# Altium schematic sheet RK3576-SMC.PMIC_BUCK (0021.0 A0).SchDoc
size 420 x 297 mm; Scale: -; DocumentType: Схема электрическая принципиальная; DocumentGOSTLIt1: ㅤ; DocumentGOSTLIt2: ㅤ; DocumentGOSTLIt3: ㅤ; DocumentGOSTNote: Элементы, отмеченные *, используются при трассировке печатной платы, в состав модуля не включаются; SheetNumber: 4; SheetTotal: 7; DocumentTypeShort: Э3; DocumentInvertoryNumber: ㅤ
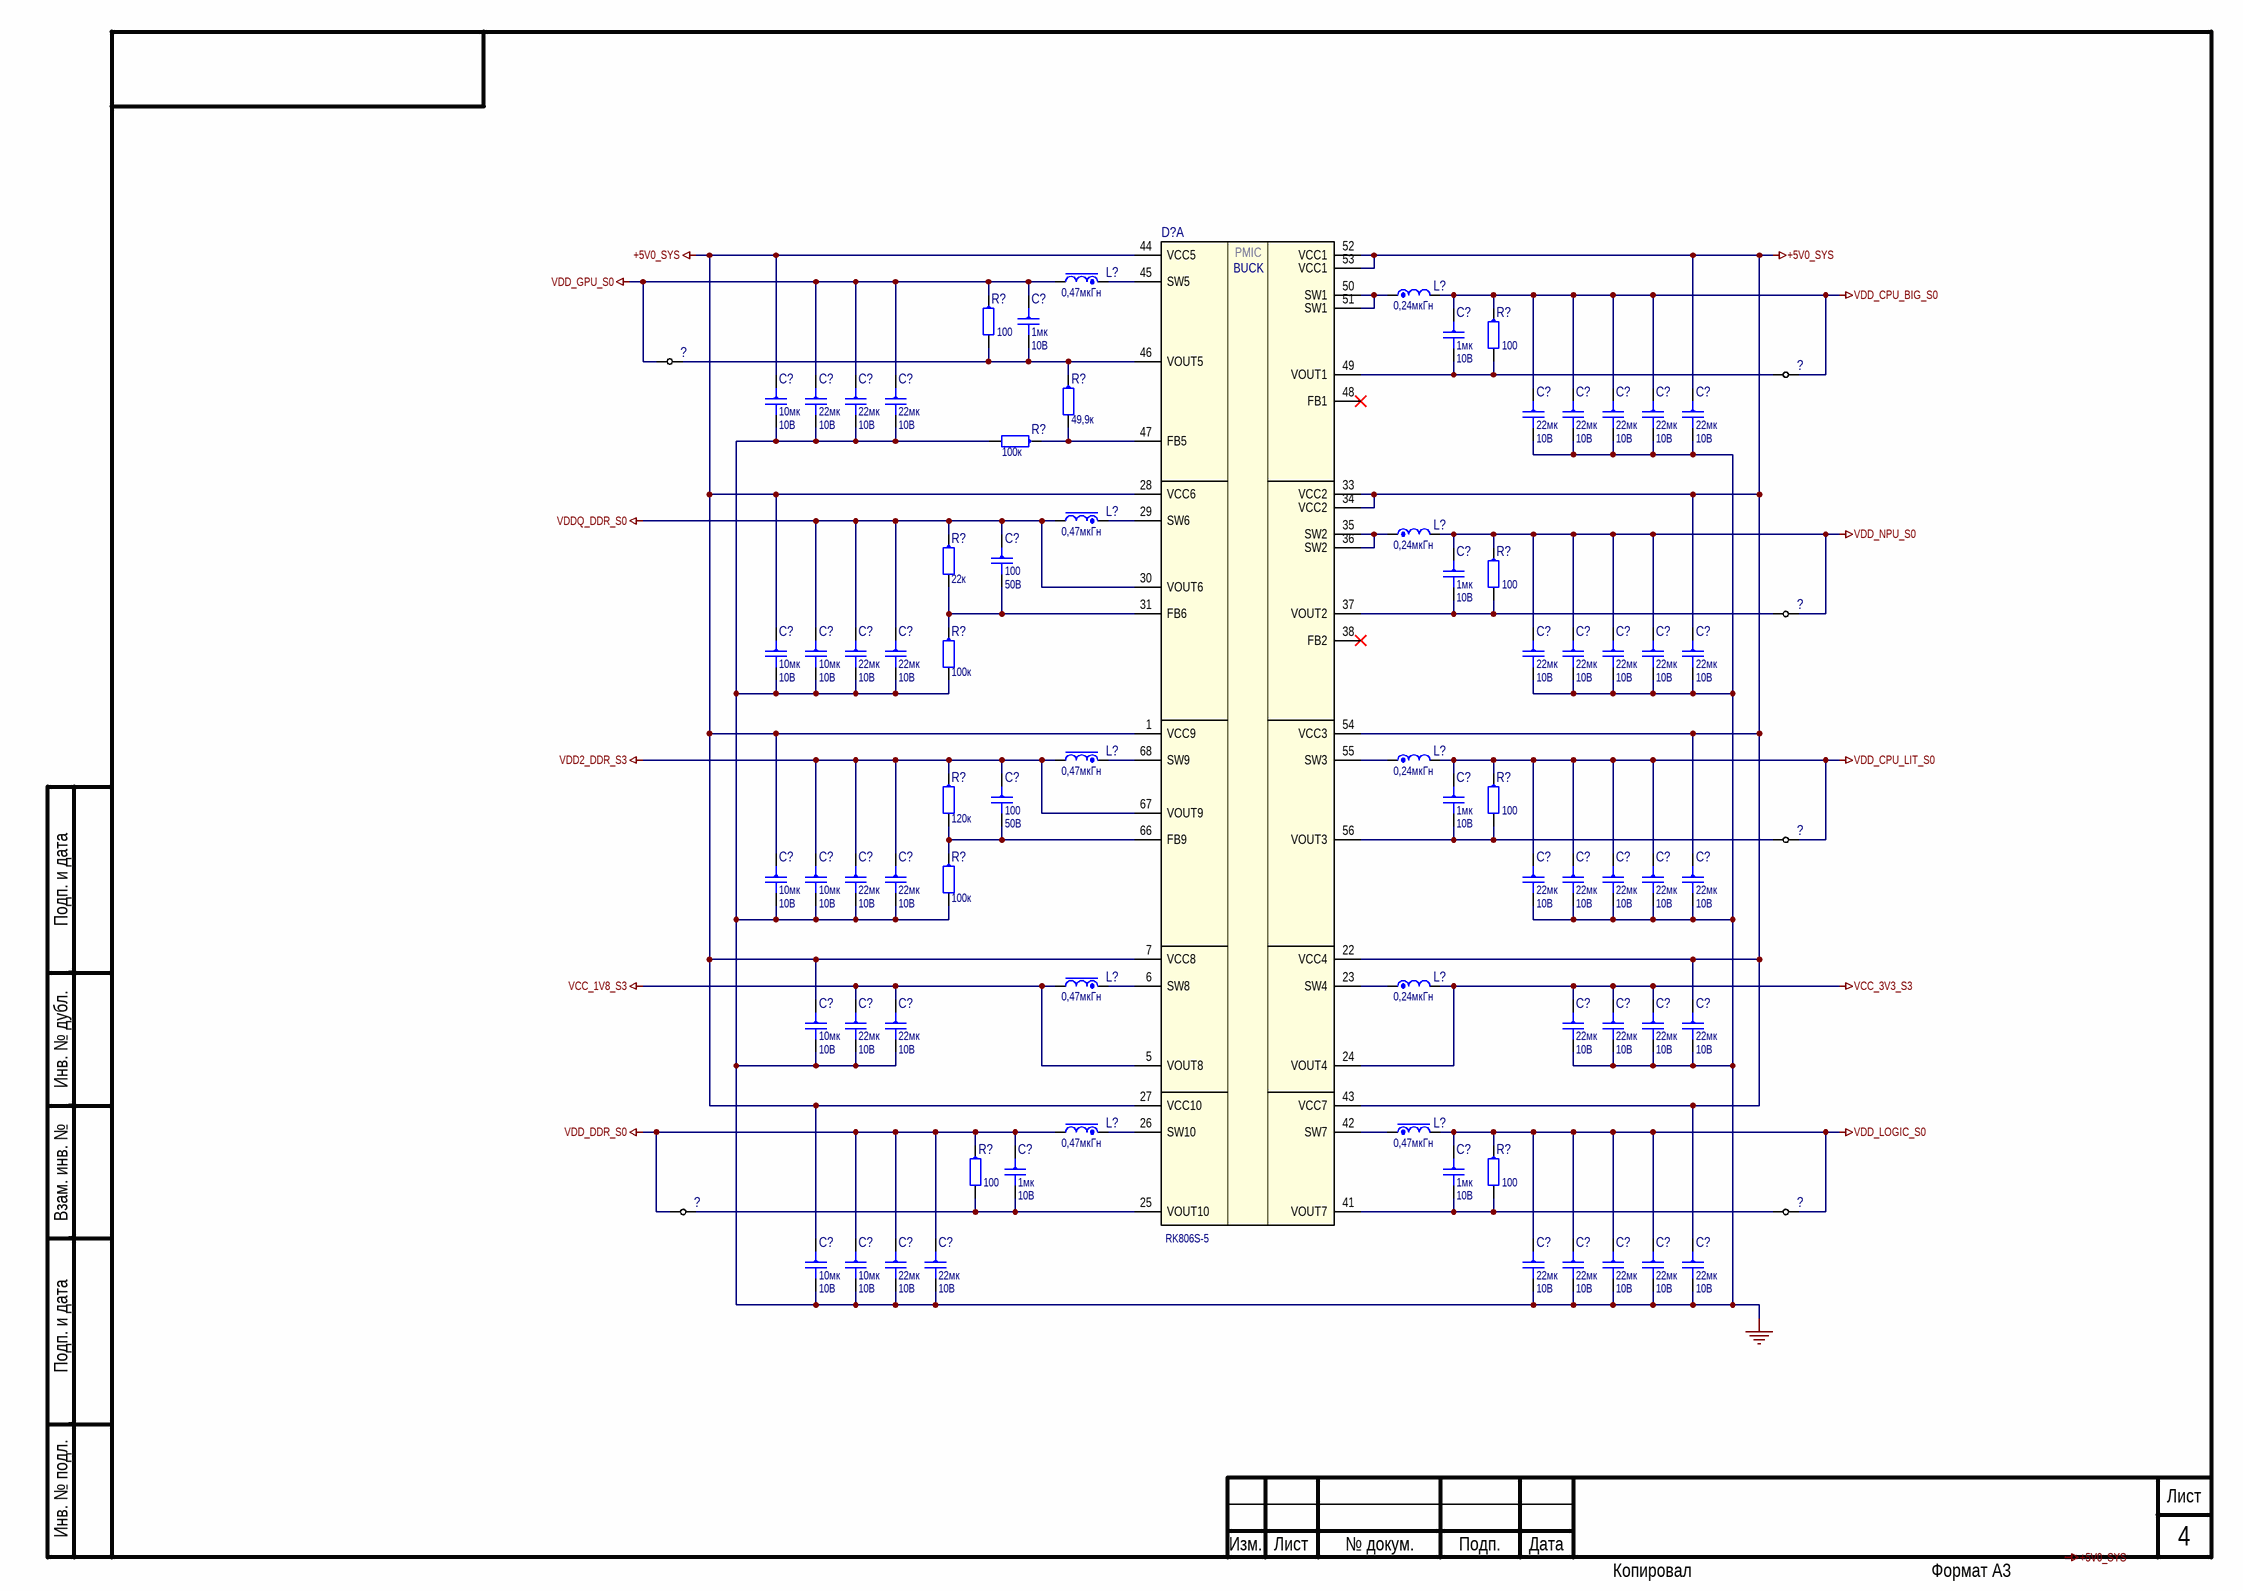
[diagram p0: RK3576-SMC.PMIC_BUCK (0021.0 A0).SchDoc]

## Parts
(Parts that share a designator on the sheet are numbered #1, #2 ... from top to bottom, then left to right.)
?#1  NetTie  [NetTie_0_6-1_25mm_close]  (value not drawn)  (net tie, no BOM)
?#2  NetTie  [NetTie_0_6-1_25mm_close]  (value not drawn)  (net tie, no BOM)
?#3  NetTie  [NetTie_0_6-1_25mm_close]  (value not drawn)  (net tie, no BOM)
?#4  NetTie  [NetTie_0_6-1_25mm_close]  (value not drawn)  (net tie, no BOM)
?#5  NetTie  [NetTie_0_6-1_25mm_close]  (value not drawn)  (net tie, no BOM)
?#6  NetTie  [NetTie_0_6-1_25mm_close]  (value not drawn)  (net tie, no BOM)
C?#1  1мк  Напряжение: 10В  [capc1005x55n]
C?#2  1мк  Напряжение: 10В  [capc1005x55n]
C?#3  10мк  Напряжение: 10В  [capc1608x100n]
C?#4  22мк  Напряжение: 10В  [capc1608x100n]
C?#5  22мк  Напряжение: 10В  [capc1608x100n]
C?#6  22мк  Напряжение: 10В  [capc1608x100n]
C?#7  22мк  Напряжение: 10В  [capc1608x100n]
C?#8  22мк  Напряжение: 10В  [capc1608x100n]
C?#9  22мк  Напряжение: 10В  [capc1608x100n]
C?#10  22мк  Напряжение: 10В  [capc1608x100n]
C?#11  22мк  Напряжение: 10В  [capc1608x100n]
C?#12  100  Напряжение: 50В  [capc1005x55n]
C?#13  1мк  Напряжение: 10В  [capc1005x55n]
C?#14  10мк  Напряжение: 10В  [capc1608x100n]
C?#15  10мк  Напряжение: 10В  [capc1608x100n]
C?#16  22мк  Напряжение: 10В  [capc1608x100n]
C?#17  22мк  Напряжение: 10В  [capc1608x100n]
C?#18  22мк  Напряжение: 10В  [capc1608x100n]
C?#19  22мк  Напряжение: 10В  [capc1608x100n]
C?#20  22мк  Напряжение: 10В  [capc1608x100n]
C?#21  22мк  Напряжение: 10В  [capc1608x100n]
C?#22  22мк  Напряжение: 10В  [capc1608x100n]
C?#23  100  Напряжение: 50В  [capc1005x55n]
C?#24  1мк  Напряжение: 10В  [capc1005x55n]
C?#25  10мк  Напряжение: 10В  [capc1608x100n]
C?#26  10мк  Напряжение: 10В  [capc1608x100n]
C?#27  22мк  Напряжение: 10В  [capc1608x100n]
C?#28  22мк  Напряжение: 10В  [capc1608x100n]
C?#29  22мк  Напряжение: 10В  [capc1608x100n]
C?#30  22мк  Напряжение: 10В  [capc1608x100n]
C?#31  22мк  Напряжение: 10В  [capc1608x100n]
C?#32  22мк  Напряжение: 10В  [capc1608x100n]
C?#33  22мк  Напряжение: 10В  [capc1608x100n]
C?#34  10мк  Напряжение: 10В  [capc1608x100n]
C?#35  22мк  Напряжение: 10В  [capc1608x100n]
C?#36  22мк  Напряжение: 10В  [capc1608x100n]
C?#37  22мк  Напряжение: 10В  [capc1608x100n]
C?#38  22мк  Напряжение: 10В  [capc1608x100n]
C?#39  22мк  Напряжение: 10В  [capc1608x100n]
C?#40  22мк  Напряжение: 10В  [capc1608x100n]
C?#41  1мк  Напряжение: 10В  [capc1005x55n]
C?#42  1мк  Напряжение: 10В  [capc1005x55n]
C?#43  10мк  Напряжение: 10В  [capc1608x100n]
C?#44  10мк  Напряжение: 10В  [capc1608x100n]
C?#45  22мк  Напряжение: 10В  [capc1608x100n]
C?#46  22мк  Напряжение: 10В  [capc1608x100n]
C?#47  22мк  Напряжение: 10В  [capc1608x100n]
C?#48  22мк  Напряжение: 10В  [capc1608x100n]
C?#49  22мк  Напряжение: 10В  [capc1608x100n]
C?#50  22мк  Напряжение: 10В  [capc1608x100n]
C?#51  22мк  Напряжение: 10В  [capc1608x100n]
D?  RK806S-5  [qfn35p700x700x90-69_hsn]  (part A of 3)
L?#1  0,47мкГн  [indm2016x100n]
L?#2  0,24мкГн  [inddfn250x200x120-2n_v1]
L?#3  0,47мкГн  [indm2016x100n]
L?#4  0,24мкГн  [inddfn250x200x120-2n_v1]
L?#5  0,47мкГн  [indm2016x100n]
L?#6  0,24мкГн  [inddfn250x200x120-2n_v1]
L?#7  0,47мкГн  [indm2016x100n]
L?#8  0,24мкГн  [inddfn250x200x120-2n_v1]
L?#9  0,47мкГн  [indm2016x100n]
L?#10  0,47мкГн  [indm2016x100n]
R?#1  100  [resc1005x40n]
R?#2  100  [resc1005x40n]
R?#3  49,9к  [resc1005x40n]
R?#4  100к  [resc1005x40n]
R?#5  22к  [resc1005x40n]
R?#6  100  [resc1005x40n]
R?#7  100к  [resc1005x40n]
R?#8  120к  [resc1005x40n]
R?#9  100  [resc1005x40n]
R?#10  100к  [resc1005x40n]
R?#11  100  [resc1005x40n]
R?#12  100  [resc1005x40n]

## Nets
+5V0_SYS: C?#3.1 C?#11.1 C?#14.1 C?#22.1 C?#25.1 C?#33.1 C?#34.1 C?#40.1 C?#43.1 C?#51.1 D?.1(VCC9) D?.7(VCC8) D?.22(VCC4) D?.27(VCC10) D?.28(VCC6) D?.33(VCC2) D?.34(VCC2) D?.43(VCC7) D?.44(VCC5) D?.52(VCC1) D?.53(VCC1) D?.54(VCC3)
SOM.GND: C?#3.2 C?#4.2 C?#5.2 C?#6.2 C?#7.2 C?#8.2 C?#9.2 C?#10.2 C?#11.2 C?#14.2 C?#15.2 C?#16.2 C?#17.2 C?#18.2 C?#19.2 C?#20.2 C?#21.2 C?#22.2 C?#25.2 C?#26.2 C?#27.2 C?#28.2 C?#29.2 C?#30.2 C?#31.2 C?#32.2 C?#33.2 C?#34.2 C?#35.2 C?#36.2 C?#37.2 C?#38.2 C?#39.2 C?#40.2 C?#43.2 C?#44.2 C?#45.2 C?#46.2 C?#47.2 C?#48.2 C?#49.2 C?#50.2 C?#51.2 R?#4.2 R?#7.2 R?#10.2
VCC_1V8_S3: C?#35.1 C?#36.1 D?.5(VOUT8) L?#7.2
VCC_3V3_S3: C?#37.1 C?#38.1 C?#39.1 D?.24(VOUT4) L?#8.2
VDD2_DDR_S3: C?#23.1 C?#26.1 C?#27.1 C?#28.1 D?.67(VOUT9) L?#5.2 R?#8.1
VDD_CPU_BIG_S0: ?#2.2 C?#2.1 C?#7.1 C?#8.1 C?#9.1 C?#10.1 L?#2.2 R?#2.1
VDD_CPU_LIT_S0: ?#4.2 C?#24.1 C?#29.1 C?#30.1 C?#31.1 C?#32.1 L?#6.2 R?#9.1
VDD_DDR_S0: ?#5.1 C?#41.1 C?#44.1 C?#45.1 C?#46.1 L?#9.2 R?#11.1
VDD_GPU_S0: ?#1.1 C?#1.1 C?#4.1 C?#5.1 C?#6.1 L?#1.2 R?#1.1
VDD_LOGIC_S0: ?#6.2 C?#42.1 C?#47.1 C?#48.1 C?#49.1 C?#50.1 L?#10.2 R?#12.1
VDD_NPU_S0: ?#3.2 C?#13.1 C?#18.1 C?#19.1 C?#20.1 C?#21.1 L?#4.2 R?#6.1
VDDQ_DDR_S0: C?#12.1 C?#15.1 C?#16.1 C?#17.1 D?.30(VOUT6) L?#3.2 R?#5.1
Net?#1_2: ?#1.2 C?#1.2 D?.46(VOUT5) R?#1.2 R?#3.1
Net?#2_1: ?#2.1 C?#2.2 D?.49(VOUT1) R?#2.2
Net?#3_1: ?#3.1 C?#13.2 D?.37(VOUT2) R?#6.2
Net?#4_1: ?#4.1 C?#24.2 D?.56(VOUT3) R?#9.2
Net?#5_2: ?#5.2 C?#41.2 D?.25(VOUT10) R?#11.2
Net?#6_1: ?#6.1 C?#42.2 D?.41(VOUT7) R?#12.2
NetC?#12_2: C?#12.2 D?.31(FB6) R?#5.2 R?#7.1
NetC?#23_2: C?#23.2 D?.66(FB9) R?#8.2 R?#10.1
NetD?_6: D?.6(SW8) L?#7.1
NetD?_23: D?.23(SW4) L?#8.1
NetD?_26: D?.26(SW10) L?#9.1
NetD?_29: D?.29(SW6) L?#3.1
NetD?_35: D?.35(SW2) D?.36(SW2) L?#4.1
NetD?_42: D?.42(SW7) L?#10.1
NetD?_45: D?.45(SW5) L?#1.1
NetD?_47: D?.47(FB5) R?#3.2 R?#4.1
NetD?_50: D?.50(SW1) D?.51(SW1) L?#2.1
NetD?_55: D?.55(SW3) L?#6.1
NetD?_68: D?.68(SW9) L?#5.1

Not connected (* = marked no-connect by the designer): D? 38(FB2)* 48(FB1)*

## Notes on the sheet
- Labels drawn without touching a wire or pin: +5V0_SYS
- Подп. и дата
- Инв. № дубл.
- Взам. инв. №
- Инв. № подл.
- Изм.
- Лист
- № докум.
- Подп.
- Дата
- Копировал
- Формат А3
- (in symbol RK806S-5, part A) PMIC; BUCK

## Library data of the parts
?#1-?#6 = NetTie_0.6-1.25_Close: Part_ID: ATB-00257; Rule: UNIONINDEX=0|RULEKIND=Clearance|NETSCOPE=DifferentNets|LAYERKIND=SameLayer|NAME=Schematic Clearance Constraint|GAP=0mil|GENERICCLEARANCE=0mil|IGNOREPADTOPADCLEARANCEINFOOTPRINT=TRUE|OBJECTCLEARANCES= |UNIT=Metric; Rule: UNIONINDEX=0|RULEKIND=PolygonConnect|NETSCOPE=AnyNet|LAYERKIND=SameLayer|NAME=Schematic Polygon Connect Style|CONNECTSTYLE=Direct|RELIEFCONDUCTORWIDTH=10mil|RELIEFENTRIES=4|POLYGONRELIEFANGLE=45 Angle|AIRGAPWIDTH=10mil|UNIT=Metric; Rule: UNIONINDEX=0|RULEKIND=ShortCircuit|NETSCOPE=AnyNet|LAYERKIND=SameLayer|NAME=Schematic Short-Circuit Constraint|ALLOWED=TRUE|UNIT=Metric; Тип ЭКБ: Элементы; Тип компонента: Перемычка; Автор: Чепиков И.В.; Part Number: NetTie_0.6-1.25_Close; Наименование: NetTie_0.6-1.25_Close; Value: -; Part_Number: NetTie_0.6-1.25_Close; Дата: 11.11.2024; Device: NetTie_0.6-1.25_Close; NameFromManufacturer: NetTie_0.6-1.25_Close
C?#1 C?#2 C?#13 C?#24 C?#41 C?#42 = CC0402KRX5R6BB105: Part_ID: ATB-00690; Manufacturer: Yageo; Schematic_Part: C_min_val,C_min,C_val,C; Тип ЭКБ: Конденсаторы; Наименование: 0402-X5R-10V-1uF±10%; Тип компонента: Конденсатор керамический; Value: 1uF; Voltage: 10V; Температура: -55 +85; PCB_Footprint: capc1005x55,capc1005x55n; Тип корпуса: Chip; Видоразмер: 1005; Вариант установки: Поверхностный; Код ERP: E2-00028722; Photo: Photos\Photos\Yageo_Capacitors.jpg; Автор: Чепиков И.В.; Точность: 10%; Device: 0402-X5R-10V-1uF±10%_Yageo; Library Ref 2: C; Library Ref 3: Cshort; Part Number: CC0402KRX5R6BB105; Datasheet: Datasheets\Capacitors\UPY-GPHC_X5R_4V-to-50V_30.pdf; Номинал: 1мк; Part_Number: CC0402KRX5R6BB105; Height: 0.55; Производитель: Yageo; Website: https://www.yageo.com/upload/media/product/productsearch/datasheet/mlcc/UPY-GPHC_X5R_4V-to-50V_30.pdf; Дата: 23.09.2024; ComponentLink1Description: UPY-GPHC_X5R_4V-to-50V_30.pdf; ComponentLink1URL: https://www.yageo.com/upload/media/product/productsearch/datasheet/mlcc/UPY-GPHC_X5R_4V-to-50V_30.pdf; NameFromManufacturer: CC0402KRX5R6BB105; Original PN: CC0402KRX5R6BB105
C?#3 C?#14 C?#15 C?#25 C?#26 C?#34 C?#43 C?#44 = CC0603KRX5R6BB106: Part_ID: ATB-01068; Manufacturer: Yageo; Schematic_Part: C_min_val,C_min,C_val,C; Тип ЭКБ: Конденсаторы; Наименование: 0603-X5R-10V-10uF±10%; Тип компонента: Конденсатор керамический; Value: 10uF; Voltage: 10V; Температура: -55 +85; Тип корпуса: Chip; Видоразмер: 1608; Вариант установки: Поверхностный; Код ERP: E2-00029011; Photo: Photos\Photos\Yageo_Capacitors.jpg; Автор: Чепиков И.В.; Точность: 10%; Device: 0603-X5R-10V-10uF±10%_Yageo; Library Ref 2: C; Library Ref 3: Cshort; Part Number: CC0603KRX5R6BB106; Datasheet: Datasheets\Capacitors\UPY-GPHC_X5R_4V-to-50V_30.pdf; Номинал: 10мк; Part_Number: CC0603KRX5R6BB106; PCB_Footprint: capc1608x100n; Height: 1; Производитель: Yageo; Website: https://www.yageo.com/upload/media/product/productsearch/datasheet/mlcc/UPY-GPHC_X5R_4V-to-50V_30.pdf; Дата: 25.09.2024; ComponentLink1Description: UPY-GPHC_X5R_4V-to-50V_30.pdf; ComponentLink1URL: https://www.yageo.com/upload/media/product/productsearch/datasheet/mlcc/UPY-GPHC_X5R_4V-to-50V_30.pdf; NameFromManufacturer: CC0603KRX5R6BB106; Original PN: CC0603KRX5R6BB106
C?#4-C?#11 C?#16-C?#22 C?#27-C?#33 C?#35-C?#40 C?#45-C?#51 = CC0603MRX5R6BB226: Part_ID: ATB-01072; Manufacturer: Yageo; Schematic_Part: C_min_val,C_min,C_val,C; Тип ЭКБ: Конденсаторы; Наименование: 0603-X5R-10V-22uF±20%; Тип компонента: Конденсатор керамический; Value: 22uF; Voltage: 10V; Температура: -55 +85; Тип корпуса: Chip; Видоразмер: 1608; Вариант установки: Поверхностный; Код ERP: E2-00006861; Photo: Photos\Photos\Yageo_Capacitors.jpg; Автор: Чепиков И.В.; Точность: 20%; Device: 0603-X5R-10V-22uF±20%_Yageo; Library Ref 2: C; Library Ref 3: Cshort; Part Number: CC0603MRX5R6BB226; Datasheet: Datasheets\Capacitors\UPY-GPHC_X5R_4V-to-50V_30.pdf; Номинал: 22мк; Part_Number: CC0603MRX5R6BB226; PCB_Footprint: capc1608x100n; Height: 1; Производитель: Yageo; Website: https://www.yageo.com/upload/media/product/productsearch/datasheet/mlcc/UPY-GPHC_X5R_4V-to-50V_30.pdf; Дата: 25.09.2024; ComponentLink1Description: UPY-GPHC_X5R_4V-to-50V_30.pdf; ComponentLink1URL: https://www.yageo.com/upload/media/product/productsearch/datasheet/mlcc/UPY-GPHC_X5R_4V-to-50V_30.pdf; NameFromManufacturer: CC0603MRX5R6BB226; Original PN: CC0603MRX5R6BB226
C?#12 C?#23 = CC0402JRNPO9BN101: Part_ID: ATB-03397; Manufacturer: Yageo; Schematic_Part: C_min_val,C_min,C_val,C; Тип ЭКБ: Конденсаторы; Наименование: 0402-NP0-50V-100pF±5%; Тип компонента: Конденсатор керамический; Value: 100pF; Voltage: 50V; Температура: -55 +125; PCB_Footprint: capc1005x55,capc1005x55n; Тип корпуса: Chip; Видоразмер: 1005; Вариант установки: Поверхностный; Photo: Photos\Photos\Yageo_Capacitors.jpg; Автор: Чепиков И.В.; Точность: 5%; Device: 0402-NP0-50V-100pF±5%_Yageo; Library Ref 2: C; Library Ref 3: Cshort; Part Number: CC0402JRNPO9BN101; Datasheet: Datasheets\Capacitors\UPY-GP_NP0_16V-to-250V_19.pdf; Номинал: 100; Part_Number: CC0402JRNPO9BN101; Height: 0.55; Производитель: Yageo; Website: https://www.yageo.com/upload/media/product/productsearch/datasheet/mlcc/UPY-GP_NP0_16V-to-250V_19.pdf; Дата: 15.10.2024; ComponentLink1Description: UPY-GP_NP0_16V-to-250V_19.pdf; ComponentLink1URL: https://www.yageo.com/upload/media/product/productsearch/datasheet/mlcc/UPY-GP_NP0_16V-to-250V_19.pdf; NameFromManufacturer: CC0402JRNPO9BN101; Original PN: CC0402JRNPO9BN101
D? = RK806S-5: Power-management integrated circuit; Part_ID: ATB-08063; Manufacturer: Rockchip; Тип ЭКБ: Микросхемы; Тип компонента: Контроллеры; Voltage: 2.7 - 5.5; Температура: -40 +125; Тип корпуса: QFN7x7-68; Вариант установки: Поверхностный; Photo: Photos\Photos\Rockchip_RK806-1.jpg; Автор: Чепиков И.В.; Part Number: RK806S-5; Наименование: RK806S-5; Datasheet: Datasheets\Microcircuits\Rockchip_RK806S_Datasheet_V1.5.pdf; Schematic_Part: RK806-1; Value: RK806S-5; Part_Number: RK806S-5; PCB_Footprint: qfn35p700x700x90-69_hsn; Height: 0.9; Производитель: Rockchip; Дата: 16.09.2025; Device: RK806S-5; ComponentLink1Description: Rockchip_RK806S_Datasheet_V1.5.pdf; NameFromManufacturer: RK806S-5; Original PN: RK806S-5
L?#1 L?#3 L?#5 L?#7 L?#9 L?#10 = WIP201610P-R47ML: SMT 2016, 0,47 мкГн, 20%, 3,5 А; Part_ID: ATB-08092; Manufacturer: Inpaq; Schematic_Part: L,L_Core; Тип ЭКБ: Дроссели; Тип компонента: Дроссель; Value: 470nH; Температура: -40 +125; Тип корпуса: Molded; Вариант установки: Поверхностный; Photo: Photos\Photos\Inpaq_WIP201610P-R47ML.jpg; Автор: Чепиков И.В.; Library Ref 2: Lcore; ComponentLink1Description: WIP201610P_L_Series.pdf; ComponentLink1URL: https://www.lcsc.com/product-detail/C964105.html?s_z=n_WIP201610P-R47ML; Part Number: WIP201610P-R47ML; Наименование: WIP201610P-R47ML; Datasheet: Datasheets\Chokes\WIP201610P_L_Series.pdf; Номинал: 0,47мкГн; Part_Number: WIP201610P-R47ML; PCB_Footprint: indm2016x100n; Height: 1; Производитель: Inpaq; Website: https://www.lcsc.com/product-detail/C964105.html?s_z=n_WIP201610P-R47ML; Точность: 20%; Дата: 17.09.2025; Device: WIP201610P-R47ML; NameFromManufacturer: WIP201610P-R47ML; Original PN: WIP201610P-R47ML
L?#2 L?#4 L?#6 L?#8 = WPN252012HR24MT: SMT 2520, 0,24 мкГн, 20%, 4,05 А; Part_ID: ATB-10004; Manufacturer: Sunlord; Schematic_Part: L; Тип ЭКБ: Дроссели; Тип компонента: Катушка индуктивности; Value: 240nH; Температура: -40 +125; Тип корпуса: DFN; Вариант установки: Поверхностный; Код ERP: E2-00040440; Photo: Photos\Photos\Sunlord_WPN252012H1R0MT.jpg; Автор: Чепиков И.В.; ComponentLink1Description: WPN Series Sunlord.pdf; ComponentLink1URL: https://www.sunlordinc.com/uploads/files/20240807/cn/WPN%C2%A0Series%C2%A0of%C2%A0SMD%C2%A0Power%C2%A0Inductor.pdf; Part Number: WPN252012HR24MT; Наименование: WPN252012HR24MT; Datasheet: Datasheets\Chokes\WPN Series Sunlord.pdf; Номинал: 0,24мкГн; Part_Number: WPN252012HR24MT; PCB_Footprint: inddfn250x200x120-2n_v1; Height: 1.2; Производитель: Sunlord; Website: https://www.sunlordinc.com/uploads/files/20240807/cn/WPN%C2%A0Series%C2%A0of%C2%A0SMD%C2%A0Power%C2%A0Inductor.pdf; Точность: 20%; Дата: 27.05.2025; Device: WPN252012HR24MT; Library Ref 2: L; NameFromManufacturer: WPN252012HR24MT; Original PN: WPN252012HR24MT
R?#1 R?#2 R?#6 R?#9 R?#11 R?#12 = RC0402FR-07100RL: Резисторы (chip) общего назначения; Part_ID: ATB-00718; Manufacturer: Yageo; Schematic_Part: R_min_val,R_min,R_val,R; Наименование: 0402-0.063W-100-100ppm±1%; Voltage: 50V; Power: 0.063; Точность: ±1%; ТКС (от  -60 до +20 град): ± 100; Ряд: E24; Температура: -55 +155; Вариант установки: Поверхностный; Код ERP: E2-00025158; Photo: Photos\Photos\Yageo_RC0075-RC2512.jpg; Автор: Чепиков И.В.; Device: 0402-0.063W-100-100ppm±1%_Yageo; Library Ref 2: R; Part Number: RC0402FR-07100RL; Тип ЭКБ: Резисторы; Datasheet: Datasheets\Resistors\PYu-RC_Group_51_RoHS_L_12.pdf; Тип компонента: Резистор; Номинал: 100; Value: 100; ТКС (от +20 град до max): ± 100; Part_Number: RC0402FR-07100RL; PCB_Footprint: resc1005x40n; Тип корпуса: Chip; Height: 0.4; Производитель: Yageo; Website: https://www.yageo.com/upload/media/product/products/datasheet/rchip/PYu-RC_Group_51_RoHS_L_12.pdf; Дата: 25.09.2024; NameFromManufacturer: RC0402FR-07100RL; ComponentLink1URL: https://www.yageo.com/upload/media/product/products/datasheet/rchip/PYu-RC_Group_51_RoHS_L_12.pdf; ComponentLink1Description: PYu-RC_Group_51_RoHS_L_12.pdf; Original PN: RC0402FR-07100RL
R?#3 = RC0402FR-0749K9L: Резисторы (chip) общего назначения; Part_ID: ATB-08887; Manufacturer: Yageo; Schematic_Part: R_min_val,R_min,R_val,R; Наименование: 0402-0.063W-49.9K-100ppm±1%; Value: 49.9k; Voltage: 50V; Power: 0.063; Точность: ±1%; ТКС (от  -60 до +20 град): ± 100; Ряд: E96; Температура: -55 +155; Вариант установки: Поверхностный; Код ERP: E2-00000557; Photo: Photos\Photos\Yageo_RC0075-RC2512.jpg; Автор: Чепиков И.В.; Device: 0402-0.063W-49.9K-100ppm±1%_Yageo; Library Ref 2: R; Part Number: RC0402FR-0749K9L; Тип ЭКБ: Резисторы; Datasheet: Datasheets\Resistors\PYu-RC_Group_51_RoHS_L_12.pdf; Тип компонента: Резистор; Номинал: 49,9к; ТКС (от +20 град до max): ± 100; Part_Number: RC0402FR-0749K9L; PCB_Footprint: resc1005x40n; Тип корпуса: Chip; Height: 0.4; Производитель: Yageo; Website: https://www.yageo.com/upload/media/product/products/datasheet/rchip/PYu-RC_Group_51_RoHS_L_12.pdf; Дата: 23.12.2024; NameFromManufacturer: RC0402FR-0749K9L; ComponentLink1URL: https://www.yageo.com/upload/media/product/products/datasheet/rchip/PYu-RC_Group_51_RoHS_L_12.pdf; ComponentLink1Description: PYu-RC_Group_51_RoHS_L_12.pdf; Original PN: RC0402FR-0749K9L
R?#4 R?#7 R?#10 = RC0402FR-07100KL: Резисторы (chip) общего назначения; Part_ID: ATB-00517; Manufacturer: Yageo; Schematic_Part: R_min_val,R_min,R_val,R; Наименование: 0402-0.063W-100K-100ppm±1%; Value: 100k; Voltage: 50V; Power: 0.063; Точность: ±1%; ТКС (от  -60 до +20 град): ± 100; Ряд: E24; Температура: -55 +155; Вариант установки: Поверхностный; Код ERP: E2-00028265; Photo: Photos\Photos\Yageo_RC0075-RC2512.jpg; Автор: Чепиков И.В.; Device: 0402-0.063W-100K-100ppm±1%_Yageo; Library Ref 2: R; Part Number: RC0402FR-07100KL; Тип ЭКБ: Резисторы; Datasheet: Datasheets\Resistors\PYu-RC_Group_51_RoHS_L_12.pdf; Тип компонента: Резистор; Номинал: 100к; ТКС (от +20 град до max): ± 100; Part_Number: RC0402FR-07100KL; PCB_Footprint: resc1005x40n; Тип корпуса: Chip; Height: 0.4; Производитель: Yageo; Website: https://www.yageo.com/upload/media/product/products/datasheet/rchip/PYu-RC_Group_51_RoHS_L_12.pdf; Дата: 23.08.2024; NameFromManufacturer: RC0402FR-07100KL; ComponentLink1URL: https://www.yageo.com/upload/media/product/products/datasheet/rchip/PYu-RC_Group_51_RoHS_L_12.pdf; ComponentLink1Description: PYu-RC_Group_51_RoHS_L_12.pdf; Original PN: RC0402FR-07100KL
R?#5 = RC0402FR-0722KL: Резисторы (chip) общего назначения; Part_ID: ATB-00822; Manufacturer: Yageo; Schematic_Part: R_min_val,R_min,R_val,R; Наименование: 0402-0.063W-22K-100ppm±1%; Value: 22k; Voltage: 50V; Power: 0.063; Точность: ±1%; ТКС (от  -60 до +20 град): ± 100; Ряд: E24; Температура: -55 +155; Вариант установки: Поверхностный; Код ERP: E2-00028777; Photo: Photos\Photos\Yageo_RC0075-RC2512.jpg; Автор: Чепиков И.В.; Device: 0402-0.063W-22K-100ppm±1%_Yageo; Library Ref 2: R; Part Number: RC0402FR-0722KL; Тип ЭКБ: Резисторы; Datasheet: Datasheets\Resistors\PYu-RC_Group_51_RoHS_L_12.pdf; Тип компонента: Резистор; Номинал: 22к; ТКС (от +20 град до max): ± 100; Part_Number: RC0402FR-0722KL; PCB_Footprint: resc1005x40n; Тип корпуса: Chip; Height: 0.4; Производитель: Yageo; Website: https://www.yageo.com/upload/media/product/products/datasheet/rchip/PYu-RC_Group_51_RoHS_L_12.pdf; Дата: 25.09.2024; NameFromManufacturer: RC0402FR-0722KL; ComponentLink1URL: https://www.yageo.com/upload/media/product/products/datasheet/rchip/PYu-RC_Group_51_RoHS_L_12.pdf; ComponentLink1Description: PYu-RC_Group_51_RoHS_L_12.pdf; Original PN: RC0402FR-0722KL
R?#8 = RC0402FR-07120KL: Резисторы (chip) общего назначения; Part_ID: ATB-00834; Manufacturer: Yageo; Schematic_Part: R_min_val,R_min,R_val,R; Наименование: 0402-0.063W-120K-100ppm±1%; Value: 120k; Voltage: 50V; Power: 0.063; Точность: ±1%; ТКС (от  -60 до +20 град): ± 100; Ряд: E24; Температура: -55 +155; Вариант установки: Поверхностный; Код ERP: E2-00002809; Photo: Photos\Photos\Yageo_RC0075-RC2512.jpg; Автор: Чепиков И.В.; Device: 0402-0.063W-120K-100ppm±1%_Yageo; Library Ref 2: R; Part Number: RC0402FR-07120KL; Тип ЭКБ: Резисторы; Datasheet: Datasheets\Resistors\PYu-RC_Group_51_RoHS_L_12.pdf; Тип компонента: Резистор; Номинал: 120к; ТКС (от +20 град до max): ± 100; Part_Number: RC0402FR-07120KL; PCB_Footprint: resc1005x40n; Тип корпуса: Chip; Height: 0.4; Производитель: Yageo; Website: https://www.yageo.com/upload/media/product/products/datasheet/rchip/PYu-RC_Group_51_RoHS_L_12.pdf; Дата: 25.09.2024; NameFromManufacturer: RC0402FR-07120KL; ComponentLink1URL: https://www.yageo.com/upload/media/product/products/datasheet/rchip/PYu-RC_Group_51_RoHS_L_12.pdf; ComponentLink1Description: PYu-RC_Group_51_RoHS_L_12.pdf; Original PN: RC0402FR-07120KL